# Altium project esp32-programmer.PrjPcb
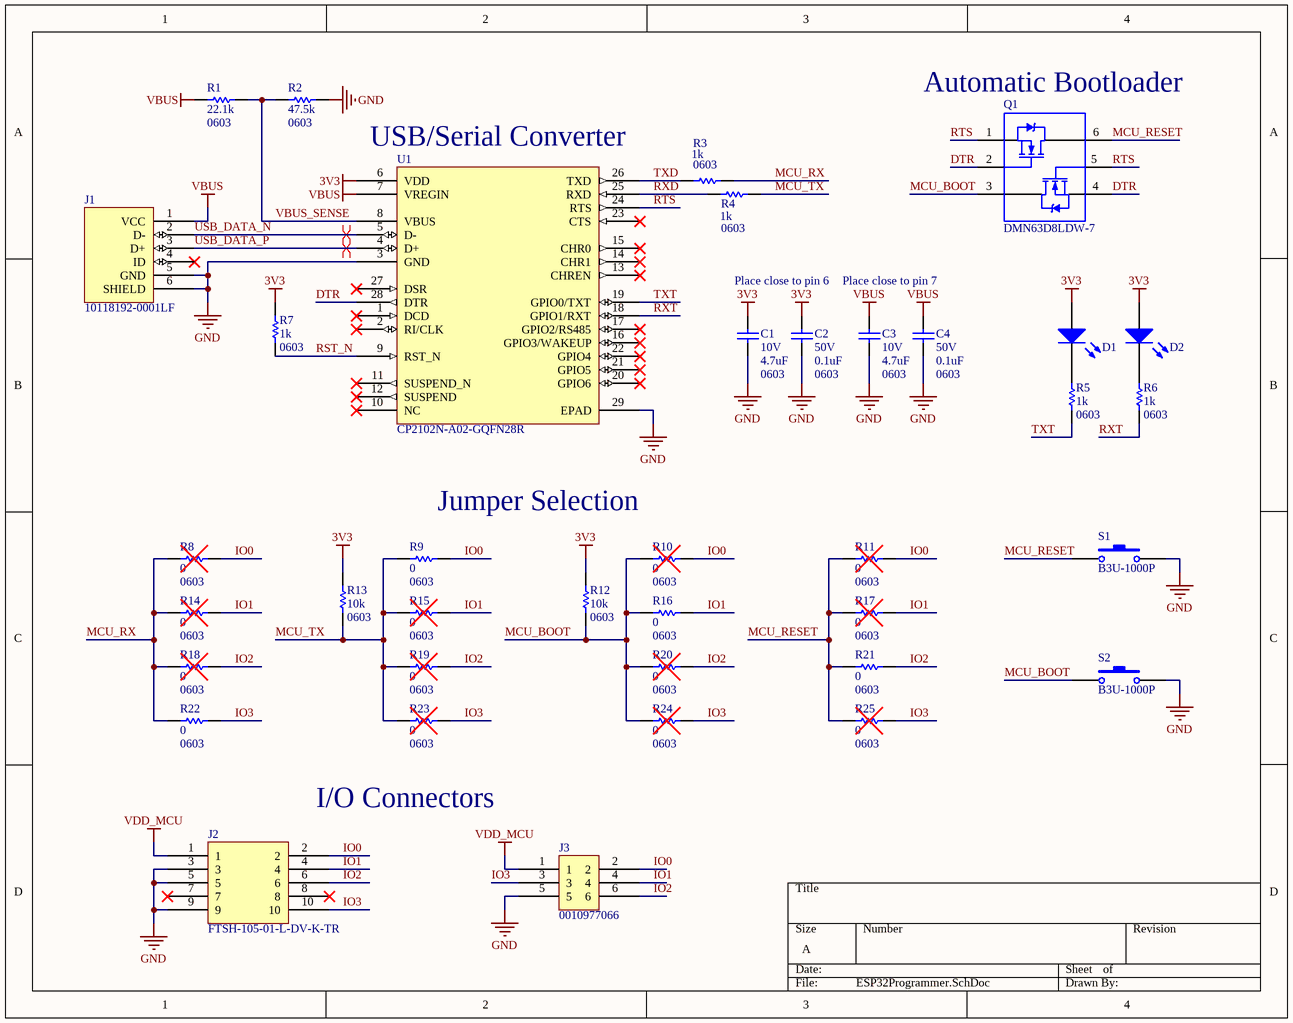
[diagram p0: ESP32Programmer.SchDoc]
1 sheet, 38 parts. Net scope: global (net labels, ports and power ports of the same name join across sheets).
Board file: ESP32Programmer.PcbDoc

## Sheet ESP32Programmer.SchDoc
size A; SheetNumber: 1; SheetTotal: 1

### Parts
C1  value 4.7uF  Rated Voltage: 10V  Package: 0603  [CAPC1608X09N]  (hidden comment: Capacitor)
C2  value 0.1uF  Rated Voltage: 50V  Package: 0603  [CAPC1608X09N]  (hidden comment: Capacitor)
C3  value 4.7uF  Rated Voltage: 10V  Package: 0603  [CAPC1608X09N]  (hidden comment: Capacitor)
C4  value 0.1uF  Rated Voltage: 50V  Package: 0603  [CAPC1608X09N]  (hidden comment: Capacitor)
D1  LED  [DIOC1608X09N]  (value not drawn)
D2  LED  [DIOC1608X09N]  (value not drawn)
J1  10118192-0001LF  [10118192-0001LF]
J2  FTSH-105-01-L-DV-K-TR  [FTSH-105-01-L-DV-K-TR]
J3  0010977066  [3X2 MALE HEADER]
Q1  DMN63D8LDW-7  [SOT65P210X110-6N]
R1  value 22.1k  Package: 0603  [RESC1608X06N]  (hidden comment: Resistor)
R2  value 47.5k  Package: 0603  [RESC1608X06N]  (hidden comment: Resistor)
R3  value 1k  Package: 0603  [RESC1608X06N]  (hidden comment: Resistor)
R4  value 1k  Package: 0603  [RESC1608X06N]  (hidden comment: Resistor)
R5  value 1k  Package: 0603  [RESC1608X06N]  (hidden comment: Resistor)
R6  value 1k  Package: 0603  [RESC1608X06N]  (hidden comment: Resistor)
R7  value 1k  Package: 0603  [RESC1608X06N]  (hidden comment: Resistor)
R8  value 0  Package: 0603  [RESC1608X06N]  (hidden comment: Resistor)
R9  value 0  Package: 0603  [RESC1608X06N]  (hidden comment: Resistor)
R10  value 0  Package: 0603  [RESC1608X06N]  (hidden comment: Resistor)
R11  value 0  Package: 0603  [RESC1608X06N]  (hidden comment: Resistor)
R12  value 10k  Package: 0603  [RESC1608X06N]  (hidden comment: Resistor)
R13  value 10k  Package: 0603  [RESC1608X06N]  (hidden comment: Resistor)
R14  value 0  Package: 0603  [RESC1608X06N]  (hidden comment: Resistor)
R15  value 0  Package: 0603  [RESC1608X06N]  (hidden comment: Resistor)
R16  value 0  Package: 0603  [RESC1608X06N]  (hidden comment: Resistor)
R17  value 0  Package: 0603  [RESC1608X06N]  (hidden comment: Resistor)
R18  value 0  Package: 0603  [RESC1608X06N]  (hidden comment: Resistor)
R19  value 0  Package: 0603  [RESC1608X06N]  (hidden comment: Resistor)
R20  value 0  Package: 0603  [RESC1608X06N]  (hidden comment: Resistor)
R21  value 0  Package: 0603  [RESC1608X06N]  (hidden comment: Resistor)
R22  value 0  Package: 0603  [RESC1608X06N]  (hidden comment: Resistor)
R23  value 0  Package: 0603  [RESC1608X06N]  (hidden comment: Resistor)
R24  value 0  Package: 0603  [RESC1608X06N]  (hidden comment: Resistor)
R25  value 0  Package: 0603  [RESC1608X06N]  (hidden comment: Resistor)
S1  B3U-1000P  [B3U-1000P]
S2  B3U-1000P  [B3U-1000P]
U1  CP2102N-A02-GQFN28R  [QFN50P500X500X80_HS-29N]

### Nets
3V3: C1.2 C2.2 D1.1(A) D2.1(A) R7.1 R12.1 R13.1 U1.6(VDD)
GND: C1.1 C2.1 C3.1 C4.1 J1.5(GND) J1.6(SHIELD) J2.3 J2.5 J2.9 J3.5 R2.2 S1.2 S2.2 U1.3(GND) U1.29(EPAD)
VBUS: C3.2 C4.2 J1.1(VCC) R1.1 U1.7(VREGIN)
VDD_MCU: J2.1 J3.1
DTR: Q1.2(G1) Q1.4(S2) U1.28(DTR)
IO0: J2.2 J3.2 R8.2 R9.2 R10.2 R11.2
IO1: J2.4 J3.4 R14.2 R15.2 R16.2 R17.2
IO2: J2.6 J3.6 R18.2 R19.2 R20.2 R21.2
IO3: J2.10 J3.3 R22.2 R23.2 R24.2 R25.2
MCU_BOOT: Q1.3(D2) R10.1 R12.2 R16.1 R20.1 R24.1 S2.1
MCU_RESET: Q1.6(D1) R11.1 R17.1 R21.1 R25.1 S1.1
MCU_RX: R3.1 R8.1 R14.1 R18.1 R22.1
MCU_TX: R4.1 R9.1 R13.2 R15.1 R19.1 R23.1
RST_N: R7.2 U1.9(RST_N)
RTS: Q1.1(S1) Q1.5(G2) U1.24(RTS)
RXD: R4.2 U1.25(RXD)
RXT: R6.2 U1.18(GPIO1/RXT)
TXD: R3.2 U1.26(TXD)
TXT: R5.2 U1.19(GPIO0/TXT)
USB_DATA_N: J1.2(D-) U1.5(D-)
USB_DATA_P: J1.3(D+) U1.4(D+)
VBUS_SENSE: R1.2 R2.1 U1.8(VBUS)
NetD1_2: D1.2(K) R5.1
NetD2_2: D2.2(K) R6.1

Not connected (* = marked no-connect by the designer): J1 4(ID)*; J2 7* 8*; U1 1(DCD)* 2(RI/CLK)* 10(NC)* 11(SUSPEND_N)* 12(SUSPEND)* 13(CHREN)* 14(CHR1)* 15(CHR0)* 16(GPIO3/WAKEUP)* 17(GPIO2/RS485)* 20(GPIO6)* 21(GPIO5)* 22(GPIO4)* 23(CTS)* 27(DSR)*

### Layout directives
differential pair: USB_DATA_N, USB_DATA_P

### Notes on the sheet
- (near Q1) Automatic Bootloader
- USB/Serial Converter
- Place close to pin 6
- Place close to pin 7
- Jumper Selection
- I/O Connectors

### Library data of the parts
C1-C4 = Capacitor: General purpose capacitor
D1 D2 = LED: General purpose LED
J1 = 10118192-0001LF: Conn Micro USB 2.0 Type B RCP 5 POS 0.65mm Solder RA SMD 5 Terminal 1 Port T/R; Manufacturer: Framatome Connectors; Gender: Receptacle; Current Rating: 1.8A; Number of Contacts: 5; Insulation Resistance: 1GR; Number of Ports: 1; Max Voltage Rating (AC): 100V; USB Standard: USB 2.0; Supplier 1: Digi-Key; Manufacturer Part Number: 10118192-0001LF; Stock 1: 43734; Pricing 1: 1 = 0.43000, 10 = 0.40500, 25 = 0.36440, 50 = 0.32400, 100 = 0.31040, 250 = 0.28344, 500 = 0.26994 (USD); Mount: Surface Mount; Contact Material: Copper Alloy; Contact Plating: Gold; Color: Black; Number of Terminals: 5; Housing Material: Polymer; Min Operating Temperature: -55°C; Max Operating Temperature: 85°C; Packaging: Tape and Reel; Package Quantity: 1400; Connector Type: USB; Termination: Solder; Voltage Rating: 100V; Orientation: Right Angle; Features: Shielded; Length: 7.86mm; Pitch: 0.65mm; Depth: 5.57mm; Radiation Hardening: No; REACH SVHC: No SVHC; Lead Free: Lead Free; Flammability Rating: UL94 V-0; ComponentLink1URL: https://datasheet.ciiva.com/26853/getdatasheetpartid-418041-26853891.pdf?src-supplier=Verical; ComponentLink1Description: https://datasheet.ciiva.com/26853/getdatasheetpartid-418041-26853891.pdf?src-supplier=Verical; ComponentLink2URL: https://datasheet.ciiva.com/851/10118192-851112.pdf?src-supplier=Digi-Key; ComponentLink2Description: https://datasheet.ciiva.com/851/10118192-851112.pdf?src-supplier=Digi-Key; ComponentLink3URL: https://datasheet.ciiva.com/4598/10118192ac-197249-4598796.pdf?src-supplier=Mouser; ComponentLink3Description: https://datasheet.ciiva.com/4598/10118192ac-197249-4598796.pdf?src-supplier=Mouser; ComponentLink4URL: http://datasheet.octopart.com/10118192-0001LF-FCI-datasheet-55953129.pdf?src-supplier=TME; ComponentLink4Description: http://datasheet.octopart.com/10118192-0001LF-FCI-datasheet-55953129.pdf?src-supplier=TME; ComponentLink5URL: http://datasheet.octopart.com/10118192-0001LF-FCI-datasheet-13423637.pdf?src-supplier=Allied+Electronics; ComponentLink5Description: http://datasheet.octopart.com/10118192-0001LF-FCI-datasheet-13423637.pdf?src-supplier=Allied+Electronics; ComponentLink6URL: http://datasheet.octopart.com/10118192-0001LF-Amphenol-datasheet-96019471.pdf?src-supplier=Newark; ComponentLink6Description: http://datasheet.octopart.com/10118192-0001LF-Amphenol-datasheet-96019471.pdf?src-supplier=Newark; ComponentLink7URL: http://datasheet.octopart.com/10118192-0001LF-Amphenol-ICC-datasheet-96019471.pdf?src-supplier=Element14; ComponentLink7Description: http://datasheet.octopart.com/10118192-0001LF-Amphenol-ICC-datasheet-96019471.pdf?src-supplier=Element14; ComponentLink8URL: http://datasheet.octopart.com/10118192-0001LF-Amphenol-ICC-datasheet-55953129.pdf?src-supplier=Future+Electronics; ComponentLink8Description: http://datasheet.octopart.com/10118192-0001LF-Amphenol-ICC-datasheet-55953129.pdf?src-supplier=Future+Electronics; ComponentLink9URL: http://datasheet.octopart.com/10118192-0001LF-Amphenol-ICC-datasheet-13423637.pdf?src-supplier=Allied+Electronics; ComponentLink9Description: http://datasheet.octopart.com/10118192-0001LF-Amphenol-ICC-datasheet-13423637.pdf?src-supplier=Allied+Electronics; ComponentLink10URL: http://datasheet.octopart.com/10118192-0001LF-ICC-datasheet-96019471.pdf?src-supplier=Farnell; ComponentLink10Description: http://datasheet.octopart.com/10118192-0001LF-ICC-datasheet-96019471.pdf?src-supplier=Farnell; ComponentLink11URL: http://datasheet.octopart.com/10118192-0001LF-ICC-datasheet-55953129.pdf?src-supplier=Farnell; ComponentLink11Description: http://datasheet.octopart.com/10118192-0001LF-ICC-datasheet-55953129.pdf?src-supplier=Farnell
J2 = FTSH-105-01-L-DV-K-TR: SAMTEC - FTSH-105-01-L-DV-K-TR - CONNECTOR, HEADER, 10 POSITION, 2ROW, 1.27MM; Number of Contacts: 10; Max Current Rating: 1.75A; Gender: Male; Connector Type: Male Pin; Row Spacing: 0.05inch; Supplier 1: Digi-Key; Manufacturer: Samtec; Manufacturer Part Number: FTSH-105-01-L-DV-K-TR; RoHS: Yes; Category: Headers and Wire Housings; Stock 1: 307; Pricing 1: 1=3.60000, 10=3.45800, 100=2.88200 (USD); Mount: Surface Mount; Contact Plating: Gold; Contact Material: Bronze; Color: Black; Housing Color: Black; Housing Material: Polymer; Min Operating Temperature: -55°C; Max Operating Temperature: 125°C; Number of Rows: 2; Termination: Solder; Packaging: Tape and Reel; Package Quantity: 550; Number of Positions: 10; Orientation: Straight; Current Rating: 1.75A; Length: 6.35mm; Pitch: 1.27mm; Contact Mating Length: 0.12inch; Depth: 3.43mm; Radiation Hardening: No; REACH SVHC: No SVHC; Lead Free: Lead Free; ComponentLink1URL: https://datasheet.ciiva.com/739/ftsh-1xx-xx-xxx-dv-xxx-mkt-739005.pdf?src-supplier=Digi-Key; ComponentLink1Description: https://datasheet.ciiva.com/739/ftsh-1xx-xx-xxx-dv-xxx-mkt-739005.pdf?src-supplier=Digi-Key; ComponentLink2URL: https://datasheet.ciiva.com/23735/81359-23735917.pdf?src-supplier=Newark; ComponentLink2Description: https://datasheet.ciiva.com/23735/81359-23735917.pdf?src-supplier=Newark; ComponentLink3URL: https://datasheet.ciiva.com/10245/ftsh-mt-10245289.pdf?src-supplier=Avnet; ComponentLink3Description: https://datasheet.ciiva.com/10245/ftsh-mt-10245289.pdf?src-supplier=Avnet
J3 = 0010977066: Conn Unshrouded Header HDR 6 POS 2.54mm Solder ST Thru-Hole C-GridR Bag; Manufacturer: Molex; Contact Resistance: 15mR; Number of Positions: 6; Gender: Male; Connector Type: Male Pin; Row Spacing: 0.1inch; Supplier 1: Digi-Key; Manufacturer Part Number: 0010977066; RoHS: Yes; Category: Headers and Wire Housings; Stock 1: 5007; Pricing 1: 1=0.51000, 10=0.43300, 100=0.33700, 1000=0.26481, 5000=0.23271, 10000=0.21666 (USD); Mount: Through Hole; Contact Plating: Gold; Contact Material: Copper Alloy; Housing Material: Polymer; Color: Black; Housing Color: Black; Min Operating Temperature: -40°C; Max Operating Temperature: 105°C; Number of Rows: 2; Packaging: Bulk; Termination: Solder; Number of Contacts: 6; Orientation: Straight; Series: C-Grid® 70280; Contact Type: Male Pin; Length: 7.62mm; Pitch: 2.54mm; Contact Mating Length: 0.32inch; Depth: 5.08mm; RoHS Compliant: Yes; ComponentLink1URL: https://datasheet.ciiva.com/742/010879125-sd-742670.pdf?src-supplier=Digi-Key; ComponentLink1Description: https://datasheet.ciiva.com/742/010879125-sd-742670.pdf?src-supplier=Digi-Key; ComponentLink2URL: https://datasheet.ciiva.com/10087/0010977066-pcb-headers-10087740.pdf?src-supplier=Avnet; ComponentLink2Description: https://datasheet.ciiva.com/10087/0010977066-pcb-headers-10087740.pdf?src-supplier=Avnet
Q1 = DMN63D8LDW-7: DIODES INC. - DMN63D8LDW-7 - Dual MOSFET, N Channel, 30 V, 260 mA, 2.8 ohm, SOT-363, Surface Mount; Rise Time: 3.2ns; Rds On Max: 2.8R; Input Capacitance: 22pF; Drain to Source Voltage (Vdss): 30V; Continuous Drain Current (ID): 260mA; Max Power Dissipation: 300mW; Turn-On Delay Time: 3.3ns; Turn-Off Delay Time: 12ns; Fall Time: 6.3ns; Number of Elements: 2; Power Dissipation: 400mW; Threshold Voltage: 1.5V; Gate to Source Voltage (Vgs): 20V; FET Type: 2 N-Channel; Supplier 1: Digi-Key; Manufacturer: Diodes; Manufacturer Part Number: DMN63D8LDW-7; RoHS: Yes; Category: MOSFETs; Stock 1: 67979; Pricing 1: 1=0.30000, 10=0.24300, 25=0.20360, 100=0.09950, 250=0.09796, 500=0.08302, 1000=0.05768 (USD); Mount: Surface Mount; Case/Package: SOT-363; Number of Pins: 6; Weight: 0.000212oz; Contact Plating: Tin,Matte; Min Operating Temperature: -55°C; Max Operating Temperature: 150°C; Package Quantity: 3000; Packaging: Tape and Reel; Drain to Source Resistance: 2.8R; Element Configuration: Dual; Number of Channels: 2; Drain to Source Breakdown Voltage: 30V; Length: 2.2mm; Height: 1mm; Width: 1.35mm; Radiation Hardening: No; REACH SVHC: No SVHC; Lead Free: Lead Free; ComponentLink1URL: https://datasheet.ciiva.com/30023/dmn63d8ldw-30023824.pdf?src-supplier=Avnet; ComponentLink1Description: https://datasheet.ciiva.com/30023/dmn63d8ldw-30023824.pdf?src-supplier=Avnet; ComponentLink2URL: https://datasheet.ciiva.com/6384/dmn63d8ldw-6384534.pdf?src-supplier=Digi-Key; ComponentLink2Description: https://datasheet.ciiva.com/6384/dmn63d8ldw-6384534.pdf?src-supplier=Digi-Key
R1-R25 = Resistor: General purpose resistor
S1 S2 = B3U-1000P: OMRON ELECTRONIC COMPONENTS         B3U-1000P            SWITCH, SPST-NO, 0.05A, 12V, SMD; Mechanical Life: 200000Cycles; Operating Force: 1.5N; Throw Configuration: SPST; Current Rating: 50mA; Contact Resistance: 100mR; Illumination Type: Non-Illuminated,Illuminated; Switch Travel: 0.15mm; Switch Function: Off-Mom; Actuator Type: Standard; Actuator Length: 0.4mm; Ratings: Dust Proof,IP40; Supplier 1: Digi-Key; Manufacturer: Omron; Manufacturer Part Number: B3U-1000P; Stock 1: 38234; Pricing 1: 1=0.84000, 10=0.80700, 25=0.76080, 50=0.66960, 100=0.60880, 250=0.57836, 500=0.56312, 1000=0.44137 (USD); RoHS: Yes; Mount: Surface Mount; Weight: 0.000776oz; Contact Material: Silver; Min Operating Temperature: -25°C; Max Operating Temperature: 70°C; Packaging: Tape and Reel; Voltage Rating (DC): 12V; Package Quantity: 1; Max Current Rating: 50mA; Termination: SMD/SMT; Orientation: Straight; Max Voltage Rating (DC): 12V; Electrical Life: 200000Cycles; Insulation Resistance: 100MR; Contact Current Rating: 50mA; Length: 4mm; Height: 1.2mm; Depth: 2.5mm; Width: 3mm; REACH SVHC: Unknown; Lead Free: Lead Free; ComponentLink1URL: https://datasheet.ciiva.com/26917/getdatasheetpartid-552554-26917552.pdf?src-supplier=Verical; ComponentLink1Description: https://datasheet.ciiva.com/26917/getdatasheetpartid-552554-26917552.pdf?src-supplier=Verical; ComponentLink2URL: https://datasheet.ciiva.com/22696/1685550-22696214.pdf?src-supplier=Element14; ComponentLink2Description: https://datasheet.ciiva.com/22696/1685550-22696214.pdf?src-supplier=Element14; ComponentLink3URL: https://datasheet.ciiva.com/1532/1685550-1532680.pdf?src-supplier=Element14; ComponentLink3Description: https://datasheet.ciiva.com/1532/1685550-1532680.pdf?src-supplier=Element14; ComponentLink4URL: https://datasheet.ciiva.com/1634/1685550-1634396.pdf?src-supplier=Farnell; ComponentLink4Description: https://datasheet.ciiva.com/1634/1685550-1634396.pdf?src-supplier=Farnell; ComponentLink5URL: https://datasheet.ciiva.com/14142/b3u-eng-datasheet-14142540.pdf?src-supplier=Distrelec; ComponentLink5Description: https://datasheet.ciiva.com/14142/b3u-eng-datasheet-14142540.pdf?src-supplier=Distrelec; ComponentLink6URL: https://datasheet.ciiva.com/2900/b3u-1110-2900029.pdf?src-supplier=Digi-Key; ComponentLink6Description: https://datasheet.ciiva.com/2900/b3u-1110-2900029.pdf?src-supplier=Digi-Key; ComponentLink7URL: https://datasheet.ciiva.com/16155/en-b3u-16155021.pdf?src-supplier=Onlinecomponents.com; ComponentLink7Description: https://datasheet.ciiva.com/16155/en-b3u-16155021.pdf?src-supplier=Onlinecomponents.com; ComponentLink8URL: https://datasheet.ciiva.com/2900/b3u-1110-2900030.pdf?src-supplier=Digi-Key; ComponentLink8Description: https://datasheet.ciiva.com/2900/b3u-1110-2900030.pdf?src-supplier=Digi-Key; ComponentLink9URL: https://datasheet.ciiva.com/16862/70176037-16862846.pdf?src-supplier=Allied+Electronics; ComponentLink9Description: https://datasheet.ciiva.com/16862/70176037-16862846.pdf?src-supplier=Allied+Electronics; ComponentLink10URL: https://datasheet.ciiva.com/2900/b3u-1110-2900031.pdf?src-supplier=Digi-Key; ComponentLink10Description: https://datasheet.ciiva.com/2900/b3u-1110-2900031.pdf?src-supplier=Digi-Key
U1 = CP2102N-A02-GQFN28R: Full Speed USB to UART Bridge USB 2.0 3.3V T/R Automotive 28-Pin QFN EP; Manufacturer: Silicon Labs; Supplier 1: Digi-Key; Manufacturer Part Number: CP2102N-A02-GQFN28R; RoHS: Yes; Stock 1: 16070; Pricing 1: 1=1.47000 (USD); ComponentLink1URL: https://4donline.ihs.com/images/VipMasterIC/IC/SILC/SILC-S-A0007770867/SILC-S-A0007770867-1.pdf?hkey=6D3A4C79FDBF58556ACFDE234799DDF0&src-supplier=Farnell; ComponentLink1Description: https://4donline.ihs.com/images/VipMasterIC/IC/SILC/SILC-S-A0007770867/SILC-S-A0007770867-1.pdf?hkey=6D3A4C79FDBF58556ACFDE234799DDF0&src-supplier=Farnell